# EAGLE design BUZZI-32 (EAGLE 4.15)
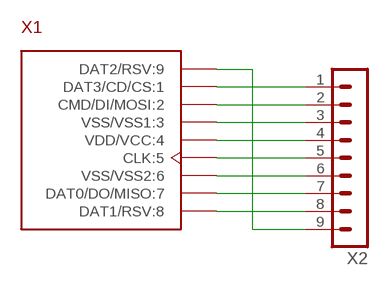
[diagram p0: schematic, sheet 1]

## Parts
X1  SD_CARD  [SD9]
X2  MA09-1  [MA09-1]

## Nets
N$1: X1.P$1(DAT3/CD/CS:1) X2.1
N$2: X1.P$2(CMD/DI/MOSI:2) X2.2
N$4: X1.P$4(VDD/VCC:4) X2.4
N$5: X1.P$5(CLK:5) X2.5
N$6: X1.P$6(VSS/VSS2:6) X2.6
N$7: X1.P$7(DAT0/DO/MISO:7) X2.7
N$8: X1.P$8(DAT1/RSV:8) X2.8
N$9: X1.P$9(DAT2/RSV:9) X2.9
X1: X1.P$3(VSS/VSS1:3) X2.3

## Library data of the parts
X1 = sd_card:SD_CARD: SD Push-Push connector type B Secure Digital Memory Card kingfont Precision Industrial co., LTD. Farnell / Order Code: 4381610 http://www.farnell.com/datasheets/37839.pdf by André Mansur - Brazil - 19/11/2004 updated - 28/10/2005
X2 = con-lstb:MA09-1: PIN HEADER

## Net classes
0 default: width 0.5 mm

## Board
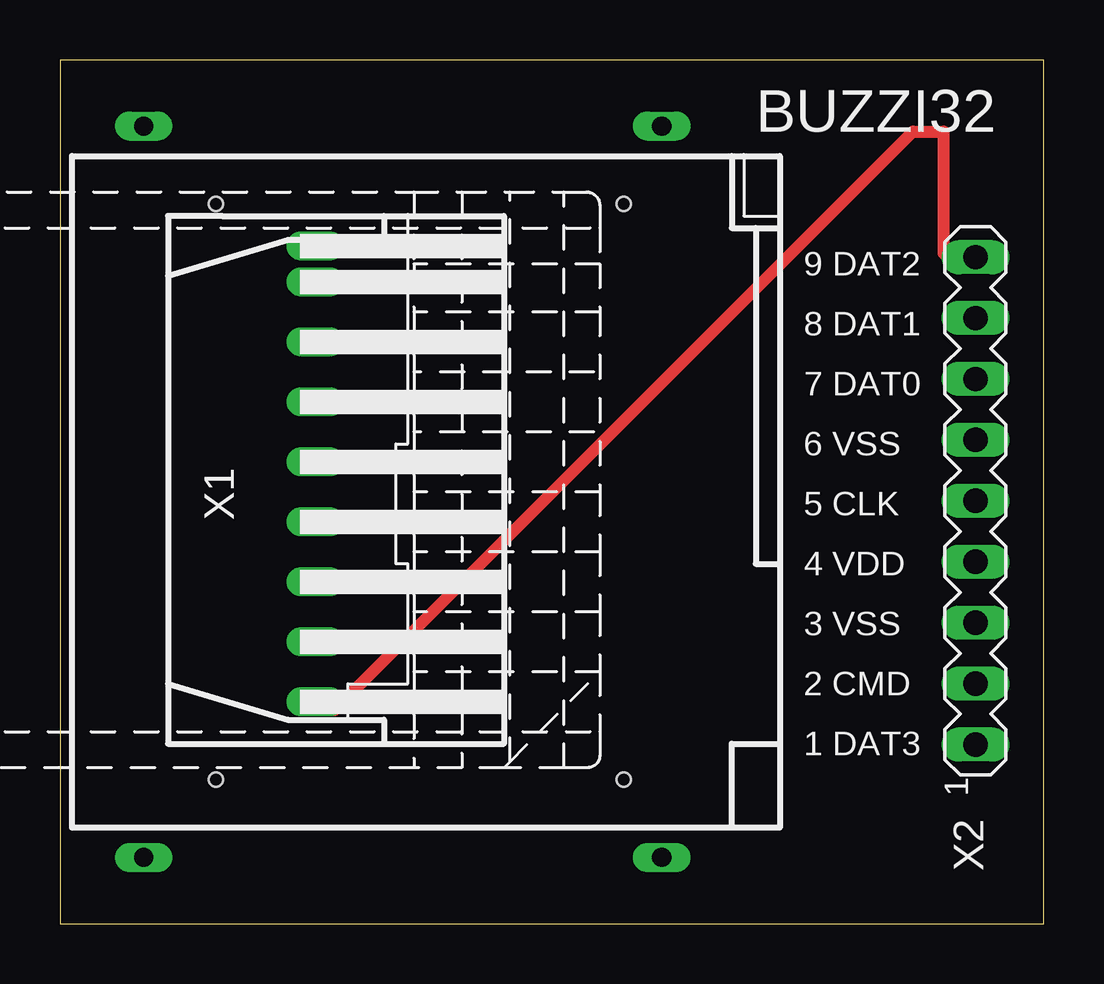
[diagram p1: board, top side]
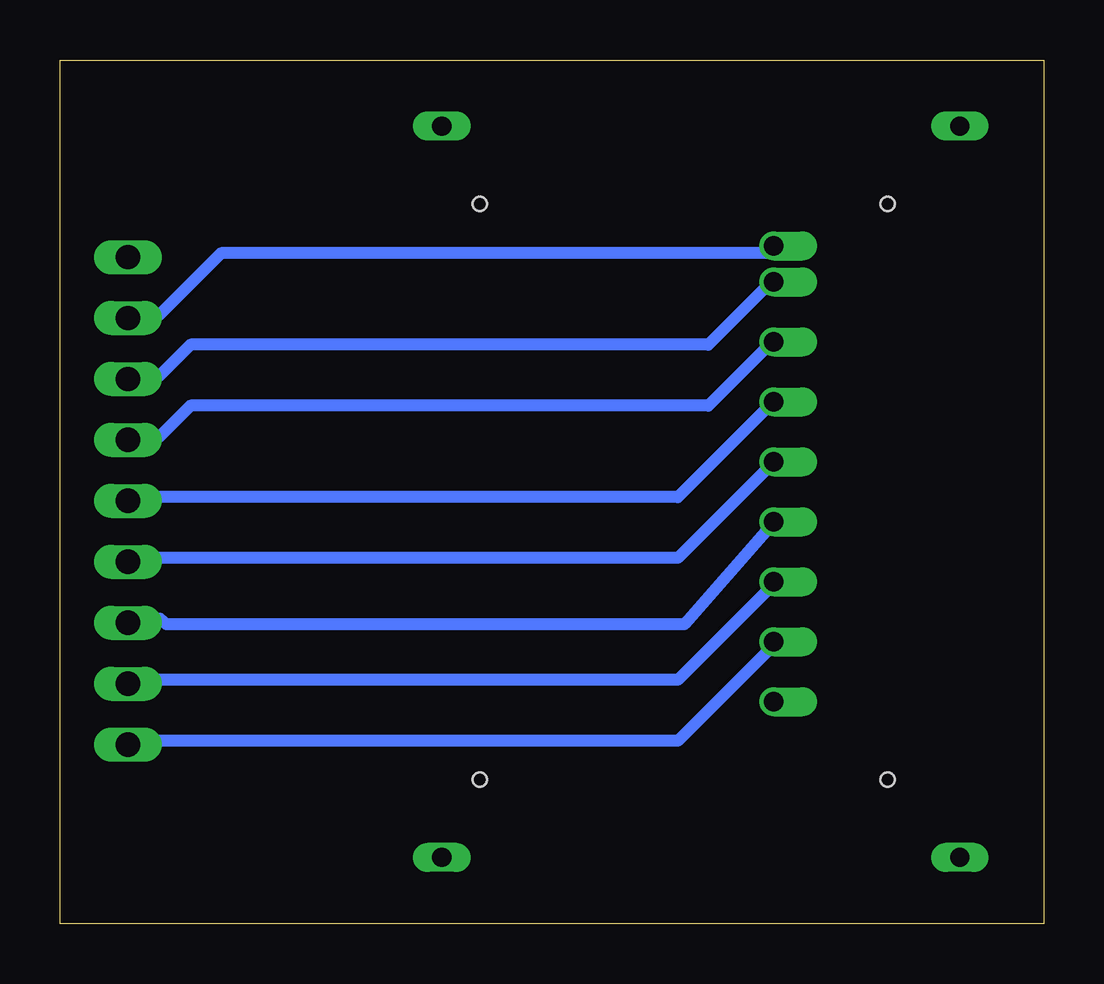
[diagram p2: board, bottom side, seen from below]

Size 41 x 36 mm. Coordinates in mm from the lower left corner, seen from the top.
Outline: 0,0 41,0 41,36 0,36 0,0
Copper layers (1*16): Top 0.035mm / dielectric 1.5mm / Bottom 0.035mm
Design rules "PCB-POOL": minimum track width 6mil, minimum drill 12mil, track to track 6mil, track to pad 6mil, pad to pad 6mil, via to via 6mil, smd to smd 6mil, copper to edge 20mil, drill to drill 8mil, minimum pad ring 8mil, minimum via ring 6mil, stop-mask expansion 3mil, vias tented up to drill 0mil, thermal gap 8mil

### Footprints (pad centres in the part's own frame; a part is rotated, then mirrored left to right if it is on the bottom)
SD9 = drill 0.8 offset: P$1 6.25,-8.75; P$2 3.75,-8.75; P$3 1.25,-8.75; P$4 -1.25,-8.75; P$5 -3.75,-8.75; P$6 -6.25,-8.75; P$7 -8.75,-8.75; P$8 -10.25,-8.75; P$9 8.75,-8.75 | drill 0.8 long: P$10 -15.24,5.08; P$11 -15.24,-16.51; P$12 15.24,-16.51; P$13 15.24,5.08 | hole 0.6: -12,-13.5; 12,-13.5; 12,3.5; -12,3.5
MA09-1 = drill 1.016 long: 1 -10.16,0; 2 -7.62,0; 3 -5.08,0; 4 -2.54,0; 5 0,0; 6 2.54,0; 7 5.08,0; 8 7.62,0; 9 10.16,0

### Placement (x,y rotation side)
X1  20,18 270 top
X2  38.16,17.62 90 top

### Tracks (layer width: path | path; a pad name or v marks a point on that pad's centre or on a via)
N$1
  Bottom 0.5: X1.P$1 11.43,11.43 15.24,7.62 36.83,7.62 X2.1
N$2
  Bottom 0.5: X1.P$2 11.43,13.97 15.24,10.16 36.83,10.16 X2.2
N$4
  Bottom 0.5: X1.P$4 11.43,19.05 15.24,15.24 36.83,15.24 X2.4
N$5
  Bottom 0.5: X1.P$5 11.43,21.59 15.24,17.78 36.83,17.78 X2.5
N$6
  Bottom 0.5: X1.P$6 11.43,24.13 13.97,21.59 35.56,21.59 36.83,20.32 X2.6
N$7
  Bottom 0.5: X1.P$7 11.43,26.67 13.97,24.13 35.56,24.13 36.83,22.86 X2.7
N$8
  Bottom 0.5: X1.P$8 11.43,27.94 34.29,27.94 36.83,25.4 X2.8
N$9
  Top 0.5: X1.P$9 11.43,8.89 35.56,33.02 36.83,33.02 36.83,27.94 X2.9
X1
  Bottom 0.5: X1.P$3 11.43,16.51 14.97,12.47 36.56,12.47 36.83,12.7 X2.3

### Text on the board
tNames: BUZZI32 | 9 DAT2 | 8 DAT1 | 7 DAT0 | 6 VSS | 5 CLK | 4 VDD | 3 VSS | 2 CMD | 1 DAT3